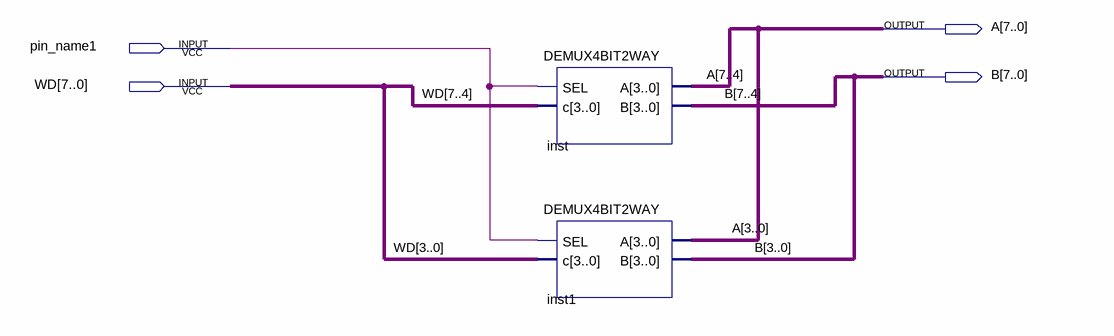
[diagram p0: schematic sheet]
// Quartus schematic DEMUX8BIT2WAY.bdf as structural Verilog: 2 symbols, 4 pins
module DEMUX8BIT2WAY (
  input  pin_name1,
  input  [7:0] WD,
  output [7:0] A,
  output [7:0] B
);

  DEMUX4BIT2WAY inst (.SEL(pin_name1), .c(WD[7:4]), .A(A[7:4]), .B(B[7:4]));
  DEMUX4BIT2WAY inst1 (.SEL(pin_name1), .c(WD[3:0]), .A(A[3:0]), .B(B[3:0]));
endmodule
